# Altium schematic sheet Processing.SchDoc
size A1; PageSetup: Record=PageOptions|CenterHorizontal=True|CenterVertical=True|PrintScale=1.00|XCorrection=1.00|YCorrection=1.00|PrintKind=1|BorderSize=5000000|LeftOffset=0|BottomOffset=0|Orientation=2|PaperLength=1000|PaperWidth=1000|Scale=100|PaperSource=7|PrintQuality=-4|MediaType=1|DitherType=10|PaperKind=A4|PrintScaleMode=0
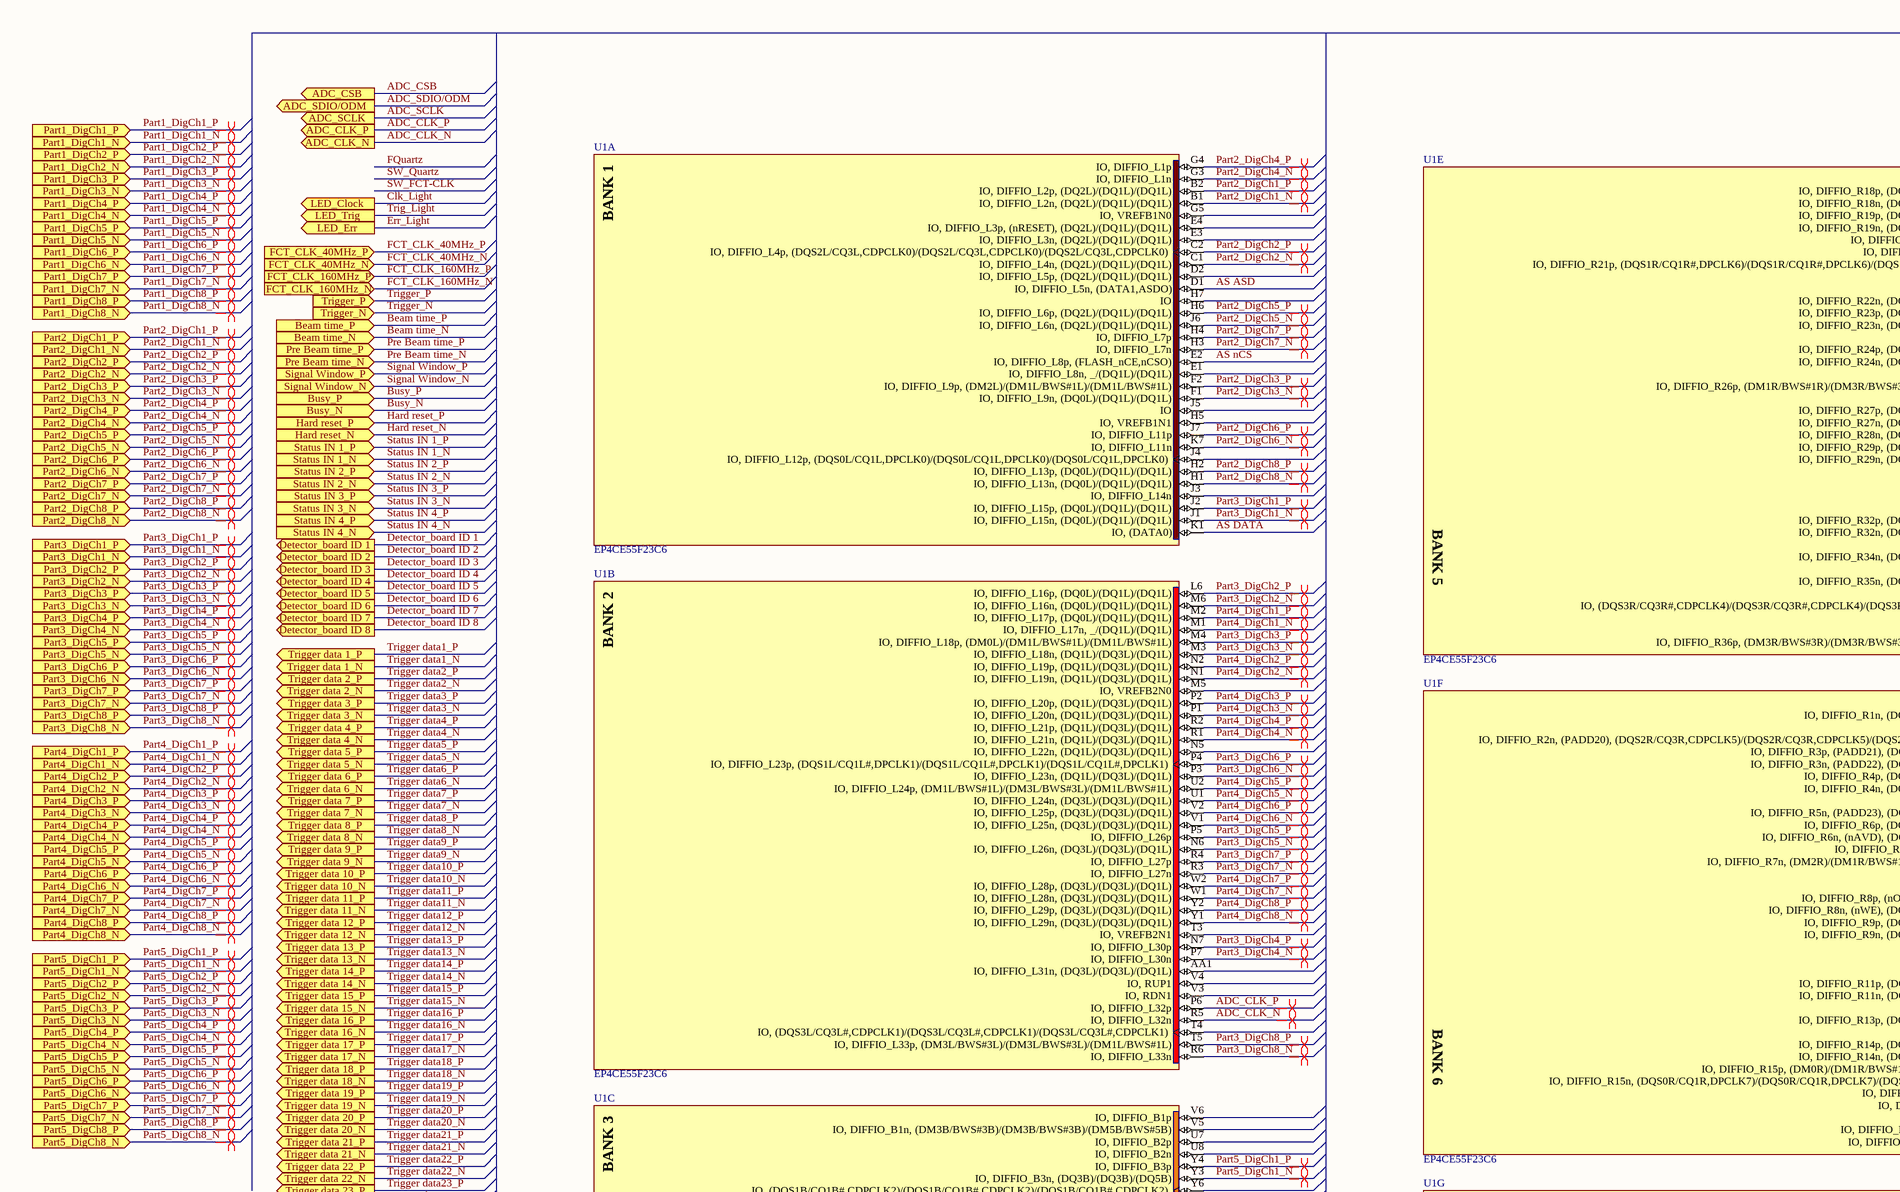
[diagram p0: Processing.SchDoc, top left]
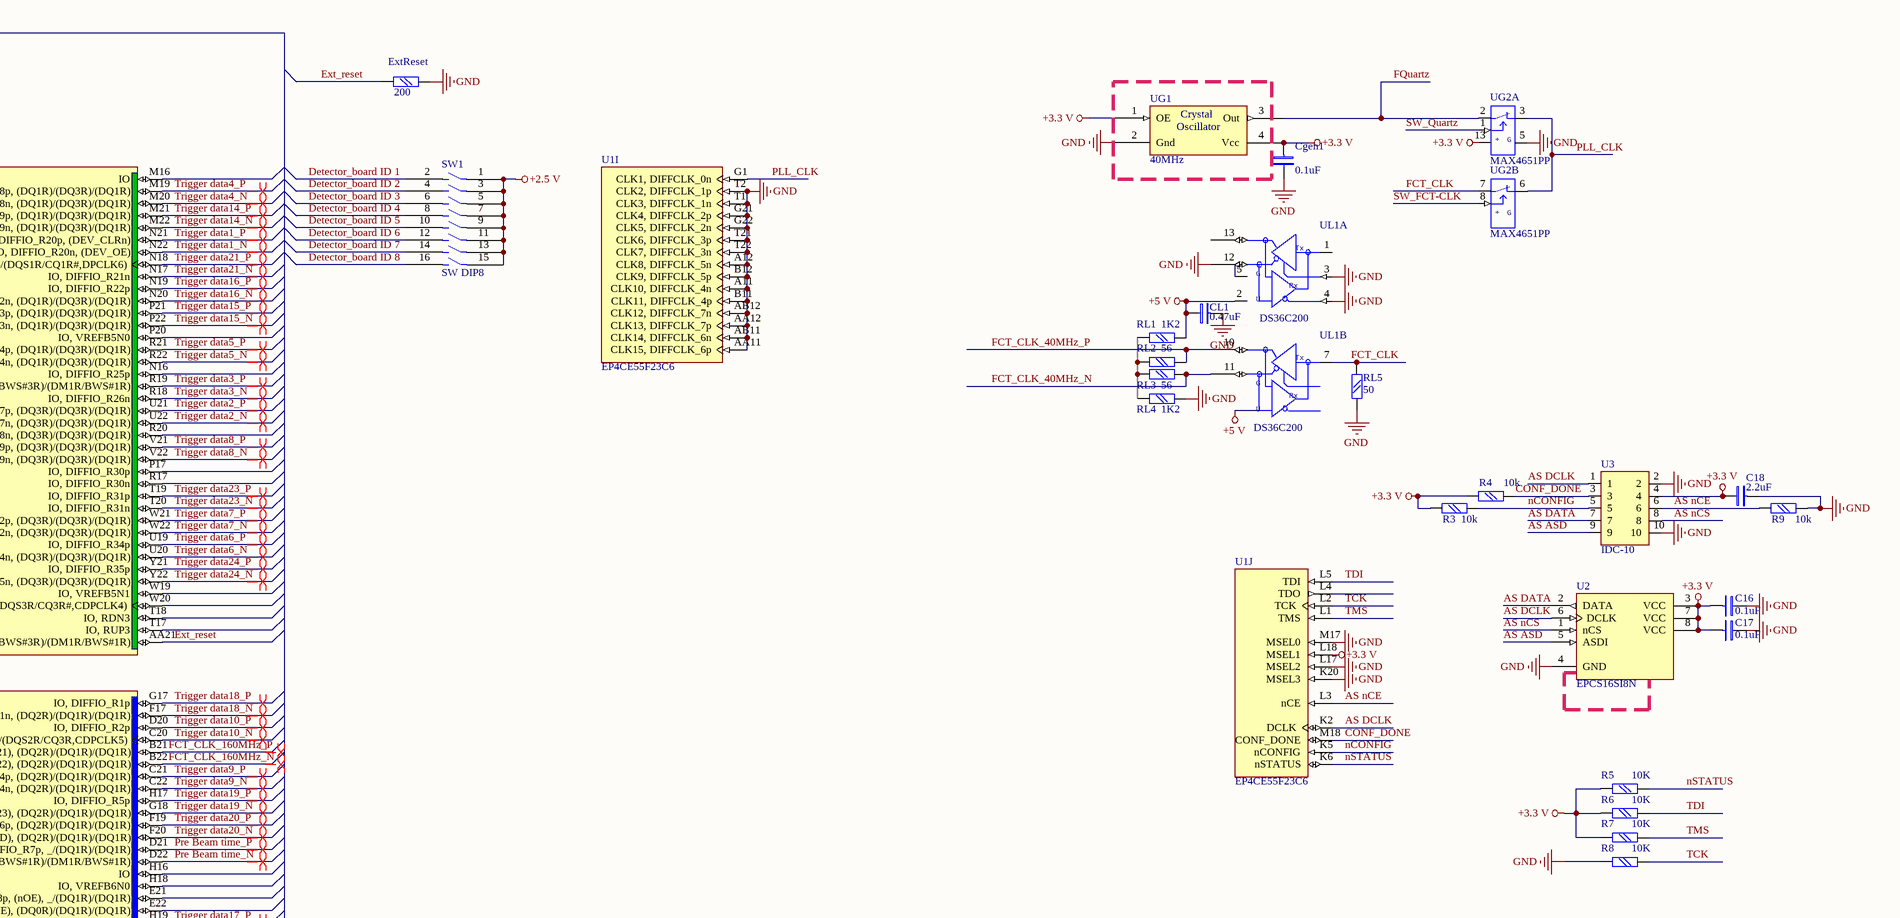
[diagram p1: Processing.SchDoc, top right]
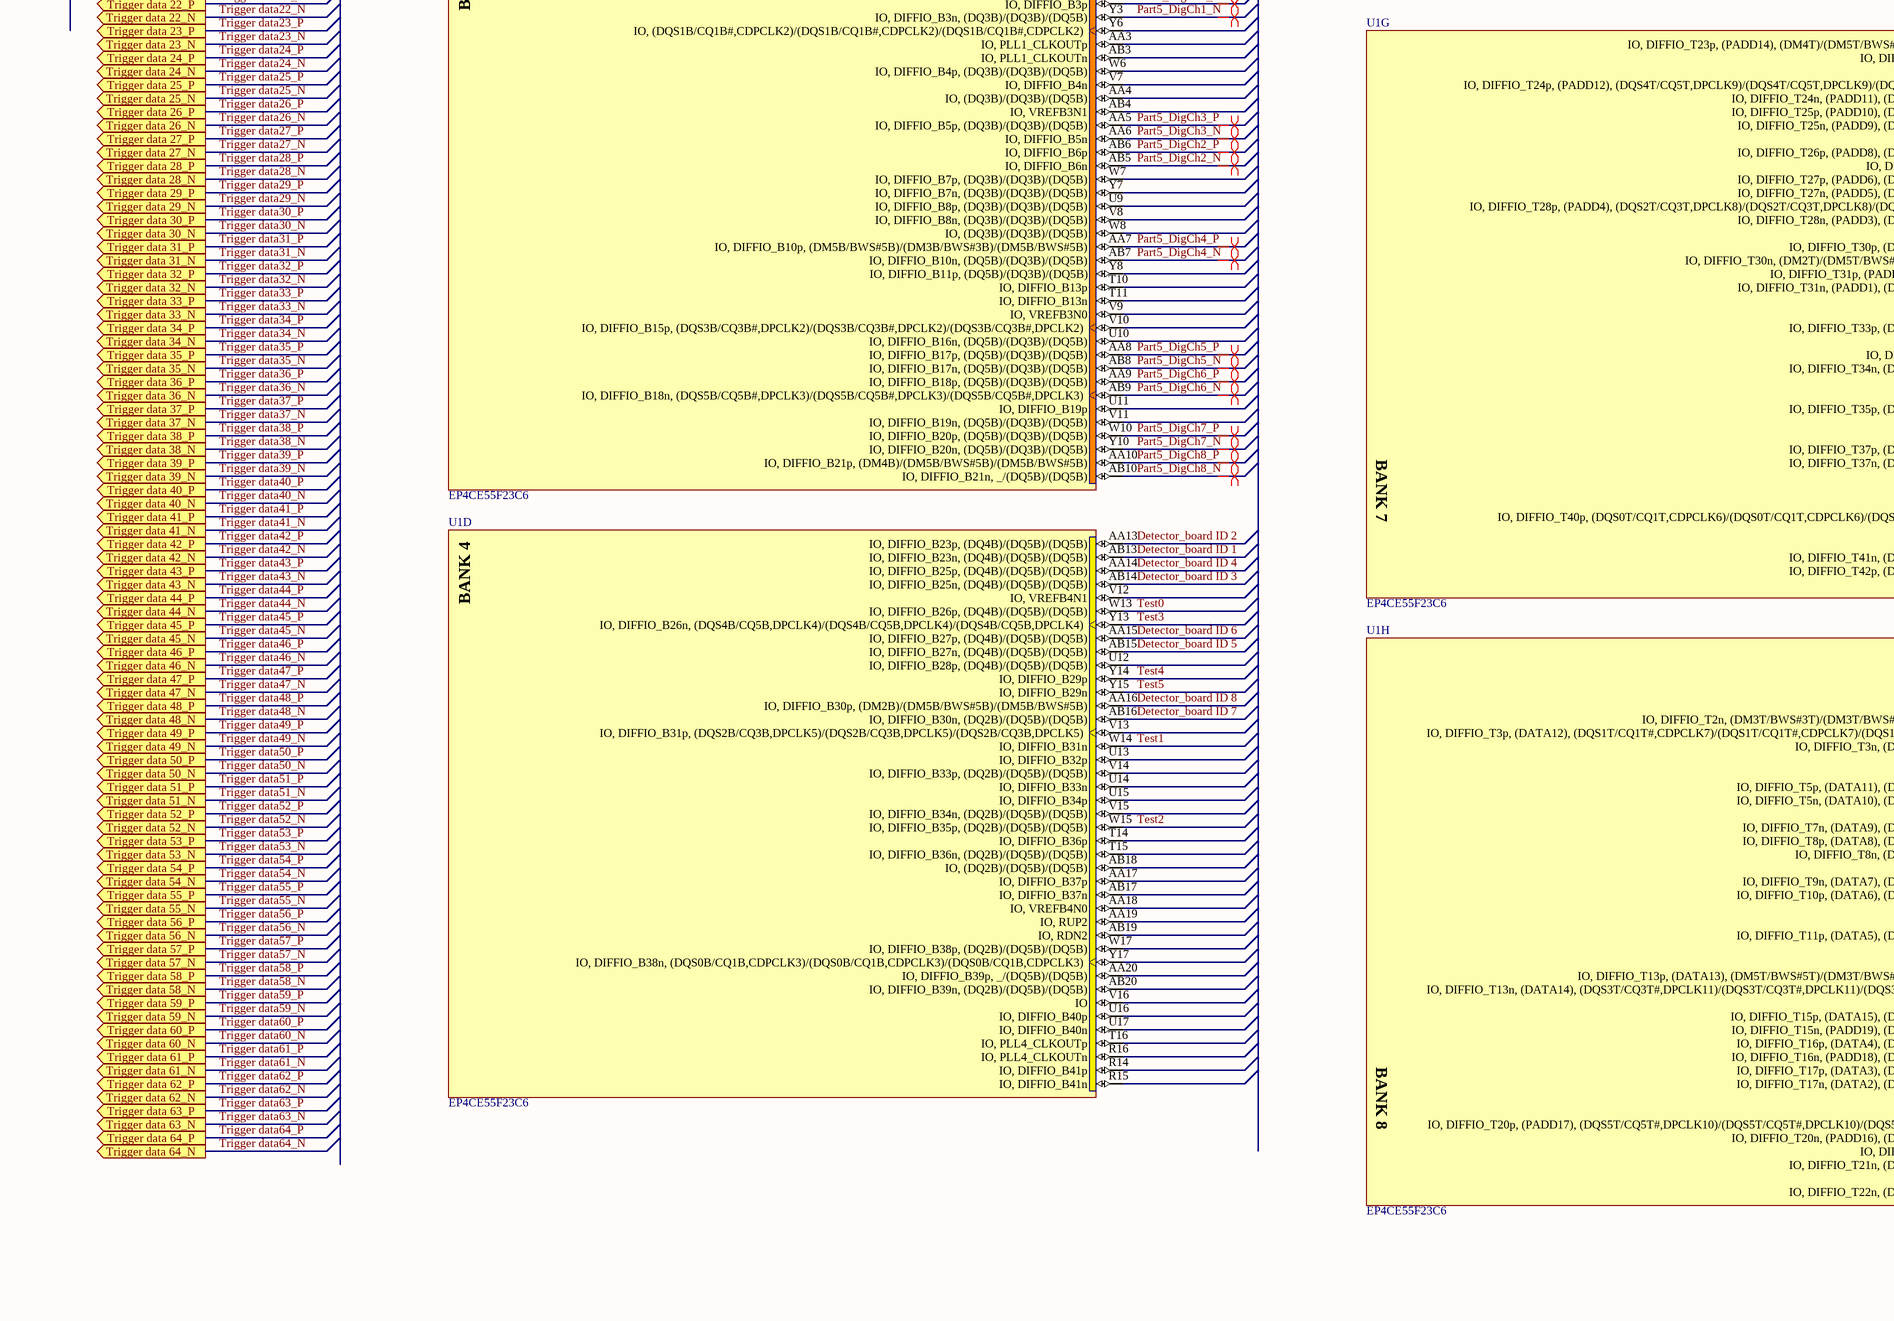
[diagram p2: Processing.SchDoc, bottom left]
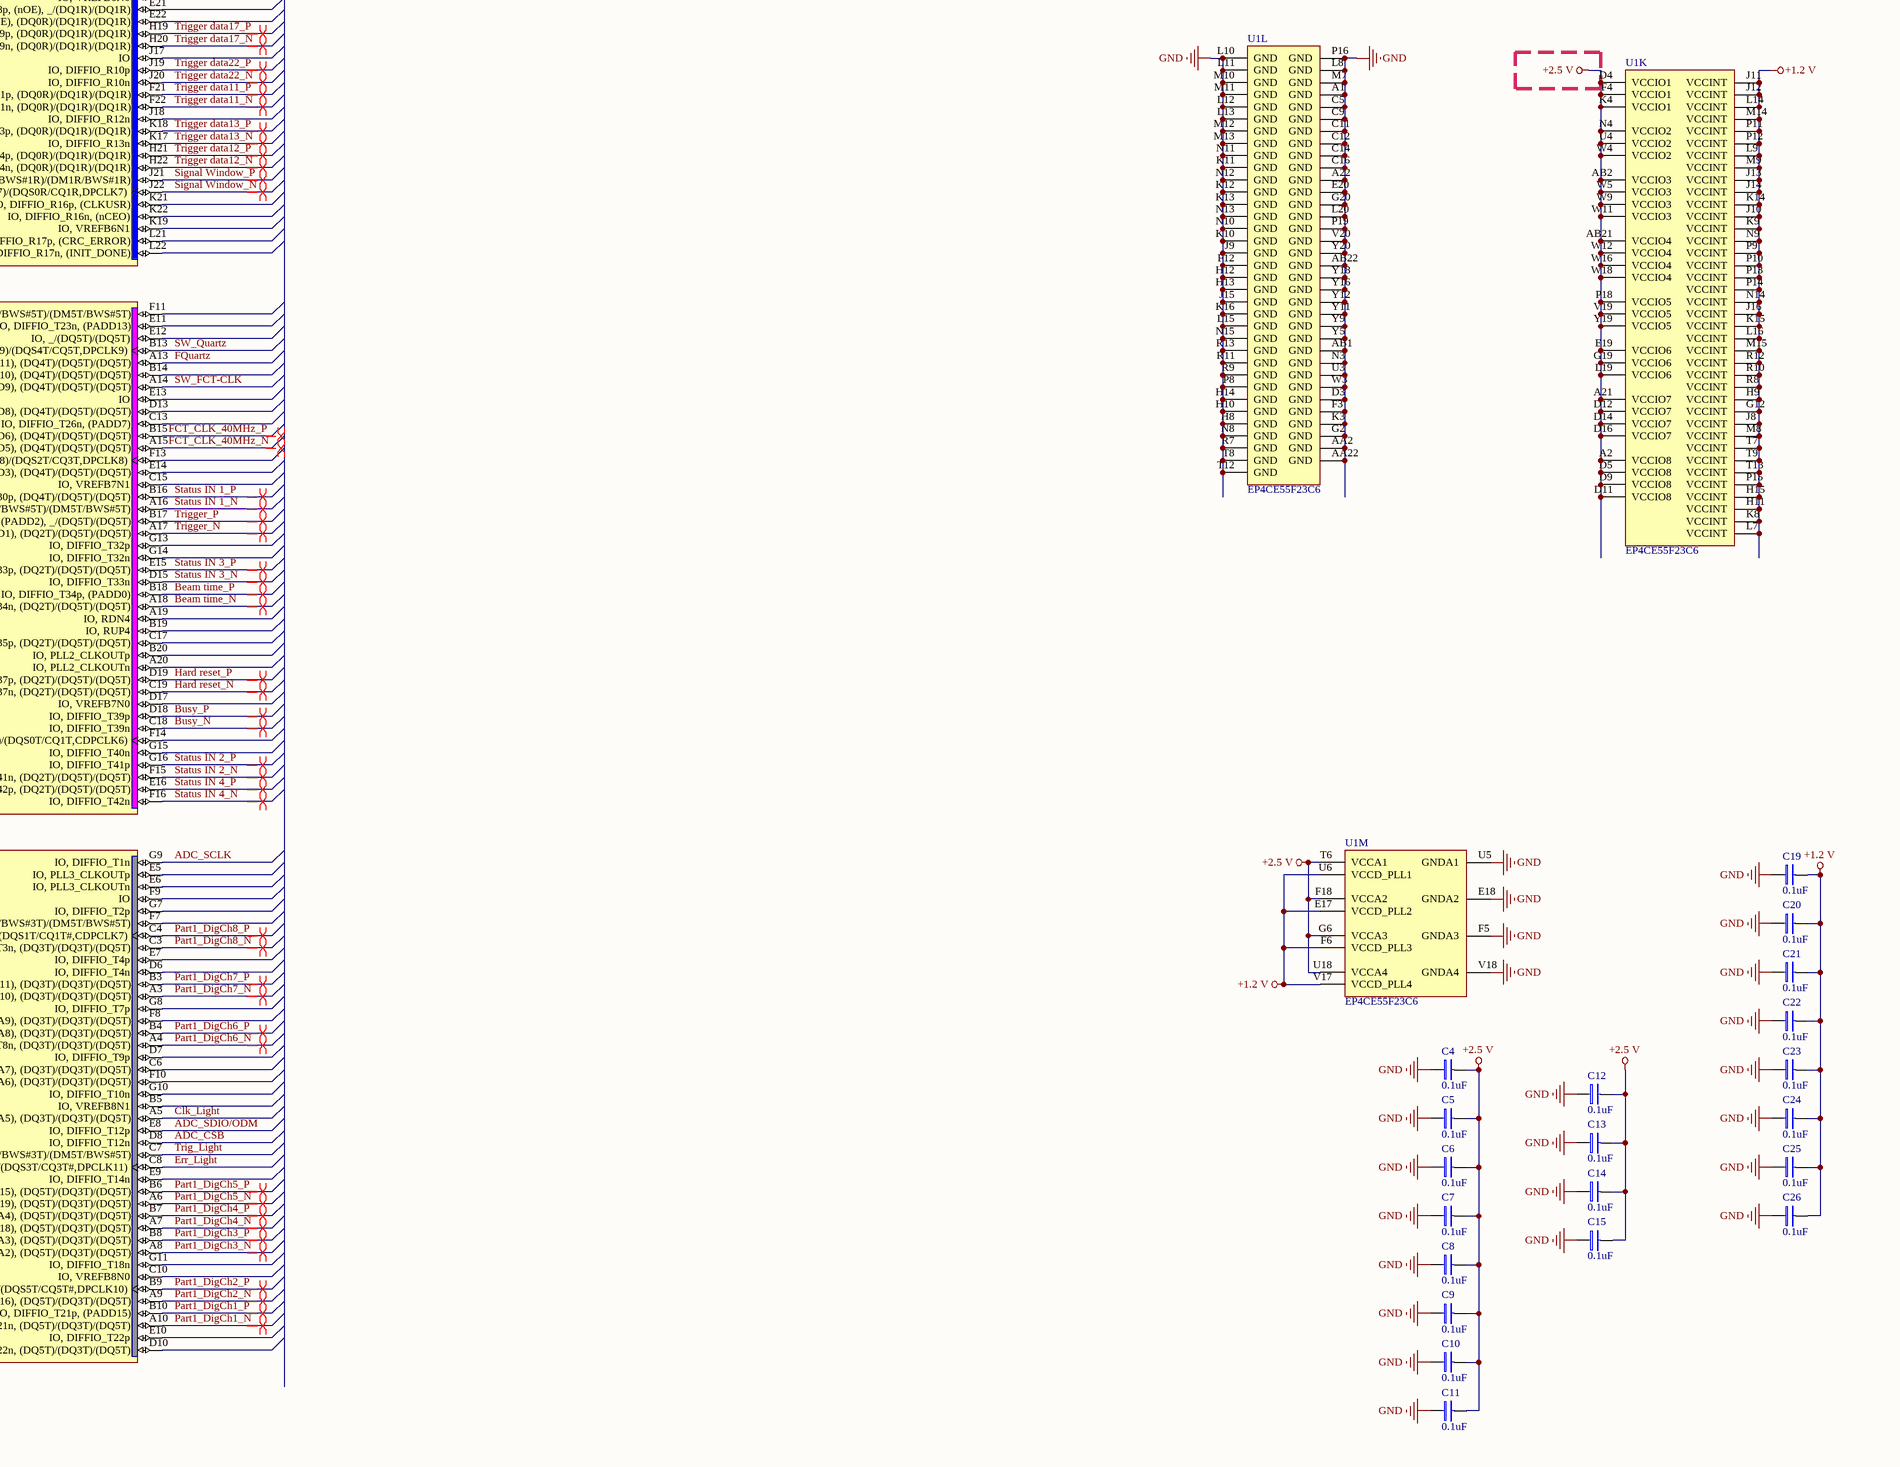
[diagram p3: Processing.SchDoc, bottom right]

## Parts
C4  0.1uF  [chip0603]
C5  0.1uF  [chip0603]
C6  0.1uF  [chip0603]
C7  0.1uF  [chip0603]
C8  0.1uF  [chip0603]
C9  0.1uF  [chip0603]
C10  0.1uF  [chip0603]
C11  0.1uF  [chip0603]
C12  0.1uF  [chip0603]
C13  0.1uF  [chip0603]
C14  0.1uF  [chip0603]
C15  0.1uF  [chip0603]
C16  0.1uF  [chip0603]
C17  0.1uF  [chip0603]
C18  2.2uF  [chip0603]
C19  0.1uF  [chip0603]
C20  0.1uF  [chip0603]
C21  0.1uF  [chip0603]
C22  0.1uF  [chip0603]
C23  0.1uF  [chip0603]
C24  0.1uF  [chip0603]
C25  0.1uF  [chip0603]
C26  0.1uF  [chip0603]
Cgen1  0.1uF  [chip0603]
CL1  0.47uF  [chip0603]
ExtReset  200  [chip0603]
R3  10k  [chip0603]
R4  10k  [chip0603]
R5  10K  [chip0603]
R6  10K  [chip0603]
R7  10K  [chip0603]
R8  10K  [chip0603]
R9  10k  [chip0603]
RL1  1K2  [chip0603]
RL2  56  [chip0603]
RL3  56  [chip0603]
RL4  1K2  [chip0603]
RL5  50  [chip0603]
SW1  SW DIP8  [SWD4-8]
U1  EP4CE55F23C6  [FBGA484]  (parts A,B,C,D,E,F,G,H,I,J,K,L,M of 13)
U2  EPCS16SI8N  [SOIC8_N]
U3  IDC-10  [IDC10]
UG1  40MHz  [SG-636]
UG2  MAX4651PP  [16SOIC150]  (parts A,B of 4)
UL1  DS36C200  [14SO200]  (parts A,B of 2)

## Ports
ADC_CLK_N (out), ADC_CLK_P (out), ADC_CSB (out), ADC_SCLK (out), ADC_SDIO/ODM (out), Beam time_N (in), Beam time_P (in), Busy_N (in), Busy_P (in), Detector_board ID 1 (out), Detector_board ID 2 (out), Detector_board ID 3 (out), Detector_board ID 4 (out), Detector_board ID 5 (out), Detector_board ID 6 (out), Detector_board ID 7 (out), Detector_board ID 8 (out), FCT_CLK_40MHz_N (in), FCT_CLK_40MHz_P (in), FCT_CLK_160MHz_N (in), FCT_CLK_160MHz_P (in), Hard reset_N (in), Hard reset_P (in), LED_Clock (out), LED_Err (out), LED_Trig (out), Part1_DigCh1_N (in), Part1_DigCh1_P (in), Part1_DigCh2_N (in), Part1_DigCh2_P (in), Part1_DigCh3_N (in), Part1_DigCh3_P (in), Part1_DigCh4_N (in), Part1_DigCh4_P (in), Part1_DigCh5_N (in), Part1_DigCh5_P (in), Part1_DigCh6_N (in), Part1_DigCh6_P (in), Part1_DigCh7_N (in), Part1_DigCh7_P (in), Part1_DigCh8_N (in), Part1_DigCh8_P (in), Part2_DigCh1_N (in), Part2_DigCh1_P (in), Part2_DigCh2_N (in), Part2_DigCh2_P (in), Part2_DigCh3_N (in), Part2_DigCh3_P (in), Part2_DigCh4_N (in), Part2_DigCh4_P (in), Part2_DigCh5_N (in), Part2_DigCh5_P (in), Part2_DigCh6_N (in), Part2_DigCh6_P (in), Part2_DigCh7_N (in), Part2_DigCh7_P (in), Part2_DigCh8_N (in), Part2_DigCh8_P (in), Part3_DigCh1_N (in), Part3_DigCh1_P (in), Part3_DigCh2_N (in), Part3_DigCh2_P (in), Part3_DigCh3_N (in), Part3_DigCh3_P (in), Part3_DigCh4_N (in), Part3_DigCh4_P (in), Part3_DigCh5_N (in), Part3_DigCh5_P (in), Part3_DigCh6_N (in), Part3_DigCh6_P (in), Part3_DigCh7_N (in), Part3_DigCh7_P (in), Part3_DigCh8_N (in), Part3_DigCh8_P (in), Part4_DigCh1_N (in), Part4_DigCh1_P (in), Part4_DigCh2_N (in), Part4_DigCh2_P (in), Part4_DigCh3_N (in), Part4_DigCh3_P (in), Part4_DigCh4_N (in), Part4_DigCh4_P (in), Part4_DigCh5_N (in), Part4_DigCh5_P (in), Part4_DigCh6_N (in), Part4_DigCh6_P (in), Part4_DigCh7_N (in), Part4_DigCh7_P (in), Part4_DigCh8_N (in), Part4_DigCh8_P (in), Part5_DigCh1_N (in), Part5_DigCh1_P (in), Part5_DigCh2_N (in), Part5_DigCh2_P (in), Part5_DigCh3_N (in), Part5_DigCh3_P (in), Part5_DigCh4_N (in), Part5_DigCh4_P (in), Part5_DigCh5_N (in), Part5_DigCh5_P (in), Part5_DigCh6_N (in), Part5_DigCh6_P (in), Part5_DigCh7_N (in), Part5_DigCh7_P (in), Part5_DigCh8_N (in), Part5_DigCh8_P (in), Pre Beam time_N (in), Pre Beam time_P (in), Signal Window_N (in), Signal Window_P (in), Status IN 1_N (in), Status IN 1_P (in), Status IN 2_N (in), Status IN 2_P (in), Status IN 3_N (in), Status IN 3_P (in), Status IN 4_N (in), Status IN 4_P (in), Trigger data 1_N (out), Trigger data 1_P (out), Trigger data 2_N (out), Trigger data 2_P (out), Trigger data 3_N (out), Trigger data 3_P (out), Trigger data 4_N (out), Trigger data 4_P (out), Trigger data 5_N (out), Trigger data 5_P (out), Trigger data 6_N (out), Trigger data 6_P (out), Trigger data 7_N (out), Trigger data 7_P (out), Trigger data 8_N (out), Trigger data 8_P (out), Trigger data 9_N (out), Trigger data 9_P (out), Trigger data 10_N (out), Trigger data 10_P (out), Trigger data 11_N (out), Trigger data 11_P (out), Trigger data 12_N (out), Trigger data 12_P (out), Trigger data 13_N (out), Trigger data 13_P (out), Trigger data 14_N (out), Trigger data 14_P (out), Trigger data 15_N (out), Trigger data 15_P (out), Trigger data 16_N (out), Trigger data 16_P (out), Trigger data 17_N (out), Trigger data 17_P (out), Trigger data 18_N (out), Trigger data 18_P (out), Trigger data 19_N (out), Trigger data 19_P (out), Trigger data 20_N (out), Trigger data 20_P (out), Trigger data 21_N (out), Trigger data 21_P (out), Trigger data 22_N (out), Trigger data 22_P (out), Trigger data 23_N (out), Trigger data 23_P (out), Trigger data 24_N (out), Trigger data 24_P (out), Trigger data 25_N (out), Trigger data 25_P (out), Trigger data 26_N (out), Trigger data 26_P (out), Trigger data 27_N (out), Trigger data 27_P (out), Trigger data 28_N (out), Trigger data 28_P (out), Trigger data 29_N (out), Trigger data 29_P (out), Trigger data 30_N (out), Trigger data 30_P (out), Trigger data 31_N (out), Trigger data 31_P (out), Trigger data 32_N (out), Trigger data 32_P (out), Trigger data 33_N (out), Trigger data 33_P (out), Trigger data 34_N (out), Trigger data 34_P (out), Trigger data 35_N (out), Trigger data 35_P (out), Trigger data 36_N (out), Trigger data 36_P (out), Trigger data 37_N (out), Trigger data 37_P (out), Trigger data 38_N (out), Trigger data 38_P (out), Trigger data 39_N (out), Trigger data 39_P (out), Trigger data 40_N (out), Trigger data 40_P (out), Trigger data 41_N (out), Trigger data 41_P (out), Trigger data 42_N (out), Trigger data 42_P (out), Trigger data 43_N (out), Trigger data 43_P (out), Trigger data 44_N (out), Trigger data 44_P (out), Trigger data 45_N (out), Trigger data 45_P (out), Trigger data 46_N (out), Trigger data 46_P (out), Trigger data 47_N (out), Trigger data 47_P (out), Trigger data 48_N (out), Trigger data 48_P (out), Trigger data 49_N (out), Trigger data 49_P (out), Trigger data 50_N (out), Trigger data 50_P (out), Trigger data 51_N (out), Trigger data 51_P (out), Trigger data 52_N (out), Trigger data 52_P (out), Trigger data 53_N (out), Trigger data 53_P (out), Trigger data 54_N (out), Trigger data 54_P (out), Trigger data 55_N (out), Trigger data 55_P (out), Trigger data 56_N (out), Trigger data 56_P (out), Trigger data 57_N (out), Trigger data 57_P (out), Trigger data 58_N (out), Trigger data 58_P (out), Trigger data 59_N (out), Trigger data 59_P (out), Trigger data 60_N (out), Trigger data 60_P (out), Trigger data 61_N (out), Trigger data 61_P (out), Trigger data 62_N (out), Trigger data 62_P (out), Trigger data 63_N (out), Trigger data 63_P (out), Trigger data 64_N (out), Trigger data 64_P (out), Trigger_N (in), Trigger_P (in)

## Nets
+1.2 V: C19.2 C20.2 C21.2 C22.2 C23.2 C24.2 C25.2 C26.2 U1.E17(VCCD_PLL2) U1.F6(VCCD_PLL3) U1.G12(VCCINT) U1.H9(VCCINT) U1.H11(VCCINT) U1.H15(VCCINT) U1.J8(VCCINT) U1.J10(VCCINT) U1.J11(VCCINT) U1.J12(VCCINT) U1.J13(VCCINT) U1.J14(VCCINT) U1.J16(VCCINT) U1.K8(VCCINT) U1.K9(VCCINT) U1.K14(VCCINT) U1.K15(VCCINT) U1.L7(VCCINT) U1.L9(VCCINT) U1.L14(VCCINT) U1.L16(VCCINT) U1.M8(VCCINT) U1.M9(VCCINT) U1.M14(VCCINT) U1.M15(VCCINT) U1.N9(VCCINT) U1.N14(VCCINT) U1.P9(VCCINT) U1.P10(VCCINT) U1.P11(VCCINT) U1.P12(VCCINT) U1.P13(VCCINT) U1.P14(VCCINT) U1.P15(VCCINT) U1.R8(VCCINT) U1.R10(VCCINT) U1.R12(VCCINT) U1.T7(VCCINT) U1.T9(VCCINT) U1.T13(VCCINT) U1.U6(VCCD_PLL1) U1.V17(VCCD_PLL4)
+2.5 V: C4.2 C5.2 C6.2 C7.2 C8.2 C9.2 C10.2 C11.2 C12.2 C13.2 C14.2 C15.2 SW1.1 SW1.3 SW1.5 SW1.7 SW1.9 SW1.11 SW1.13 SW1.15 U1.A2(VCCIO8) U1.A21(VCCIO7) U1.AB2(VCCIO3) U1.AB21(VCCIO4) U1.D4(VCCIO1) U1.D5(VCCIO8) U1.D9(VCCIO8) U1.D11(VCCIO8) U1.D12(VCCIO7) U1.D14(VCCIO7) U1.D16(VCCIO7) U1.E19(VCCIO6) U1.F4(VCCIO1) U1.F18(VCCA2) U1.G6(VCCA3) U1.G19(VCCIO6) U1.K4(VCCIO1) U1.L19(VCCIO6) U1.N4(VCCIO2) U1.P18(VCCIO5) U1.T6(VCCA1) U1.U4(VCCIO2) U1.U18(VCCA4) U1.V19(VCCIO5) U1.W4(VCCIO2) U1.W5(VCCIO3) U1.W9(VCCIO3) U1.W11(VCCIO3) U1.W12(VCCIO4) U1.W16(VCCIO4) U1.W18(VCCIO4) U1.Y19(VCCIO5)
+3.3 V: C16.2 C17.2 C18.1 Cgen1.2 R3.1 R4.1 R5.1 R6.1 R7.1 U1.L18(MSEL1) U2.3(VCC) U2.7(VCC) U2.8(VCC) U3.4 UG1.1(OE) UG1.4(Vcc) UG2.13(VCC)
+5 V: CL1.1 RL1.2 UL1.2(VCC)
GND: C4.1 C5.1 C6.1 C7.1 C8.1 C9.1 C10.1 C11.1 C12.1 C13.1 C14.1 C15.1 C16.1 C17.1 C18.2 C19.1 C20.1 C21.1 C22.1 C23.1 C24.1 C25.1 C26.1 Cgen1.1 CL1.2 ExtReset.2 R8.1 R9.2 RL4.2 RL5.2 U1.A1(GND) U1.A11(CLK10,_DIFFCLK_4n) U1.A12(CLK8,_DIFFCLK_5n) U1.A22(GND) U1.AA2(GND) U1.AA11(CLK15,_DIFFCLK_6p) U1.AA12(CLK13,_DIFFCLK_7p) U1.AA22(GND) U1.AB1(GND) U1.AB11(CLK14,_DIFFCLK_6n) U1.AB12(CLK12,_DIFFCLK_7n) U1.AB22(GND) U1.B11(CLK11,_DIFFCLK_4p) U1.B12(CLK9,_DIFFCLK_5p) U1.C5(GND) U1.C9(GND) U1.C11(GND) U1.C12(GND) U1.C14(GND) U1.C16(GND) U1.D3(GND) U1.E18(GNDA2) U1.E20(GND) U1.F3(GND) U1.F5(GNDA3) U1.F12(GND) U1.G2(GND) U1.G20(GND) U1.G21(CLK4,_DIFFCLK_2p) U1.G22(CLK5,_DIFFCLK_2n) U1.H8(GND) U1.H10(GND) U1.H12(GND) U1.H13(GND) U1.H14(GND) U1.J9(GND) U1.J15(GND) U1.K3(GND) U1.K10(GND) U1.K11(GND) U1.K12(GND) U1.K13(GND) U1.K16(GND) U1.K20(MSEL3) U1.L8(GND) U1.L10(GND) U1.L11(GND) U1.L12(GND) U1.L13(GND) U1.L15(GND) U1.L17(MSEL2) U1.L20(GND) U1.M7(GND) U1.M10(GND) U1.M11(GND) U1.M12(GND) U1.M13(GND) U1.M17(MSEL0) U1.N3(GND) U1.N8(GND) U1.N10(GND) U1.N11(GND) U1.N12(GND) U1.N13(GND) U1.N15(GND) U1.P8(GND) U1.P16(GND) U1.P19(GND) U1.R7(GND) U1.R9(GND) U1.R11(GND) U1.R13(GND) U1.T1(CLK3,_DIFFCLK_1n) U1.T2(CLK2,_DIFFCLK_1p) U1.T8(GND) U1.T12(GND) U1.T21(CLK6,_DIFFCLK_3p) U1.T22(CLK7,_DIFFCLK_3n) U1.U3(GND) U1.U5(GNDA1) U1.V18(GNDA4) U1.V20(GND) U1.W3(GND) U1.Y5(GND) U1.Y9(GND) U1.Y11(GND) U1.Y12(GND) U1.Y16(GND) U1.Y18(GND) U1.Y20(GND) U2.4(GND) U3.2 U3.10 UG1.2(Gnd) UG2.5(GND) UL1.3(TE) UL1.4(RE) UL1.12(WIRE-)
ADC_CLK_N: U1.R5(IO,_DIFFIO_L32n) ; port ADC_CLK_N
ADC_CLK_P: U1.P6(IO,_DIFFIO_L32p) ; port ADC_CLK_P
ADC_CSB: U1.D8(IO,_DIFFIO_T12n) ; port ADC_CSB
ADC_SCLK: U1.G9(IO,_DIFFIO_T1n) ; port ADC_SCLK
ADC_SDIO/ODM: U1.E8(IO,_DIFFIO_T12p) ; port ADC_SDIO/ODM
AS ASD: U1.D1(IO,_DIFFIO_L5n,_(DATA1,ASDO)) U2.5(ASDI) U3.9
AS DATA: U1.K1(IO,_(DATA0)) U2.2(DATA) U3.7
AS DCLK: U1.K2(DCLK) U2.6(DCLK) U3.1
AS nCE: R9.1 U1.L3(nCE) U3.6
AS nCS: U1.E2(IO,_DIFFIO_L8p,_(FLASH_nCE,nCSO)) U2.1(nCS) U3.8
Beam time_N: U1.A18(IO,_DIFFIO_T34n,_(DQ2T)/(DQ5T)/(DQ5T)) ; port Beam time_N
Beam time_P: U1.B18(IO,_DIFFIO_T34p,_(PADD0)) ; port Beam time_P
Busy_N: U1.C18(IO,_DIFFIO_T39n) ; port Busy_N
Busy_P: U1.D18(IO,_DIFFIO_T39p) ; port Busy_P
Clk_Light: U1.A5(IO,_DIFFIO_T11p,_(DATA5),_(DQ3T)/(DQ3T)/(DQ5T)) ; port LED_Clock
CONF_DONE: R4.2 U1.M18(CONF_DONE) U3.3
Detector_board ID 1: SW1.2 U1.AB13(IO,_DIFFIO_B23n,_(DQ4B)/(DQ5B)/(DQ5B)) ; port Detector_board ID 1
Detector_board ID 2: SW1.4 U1.AA13(IO,_DIFFIO_B23p,_(DQ4B)/(DQ5B)/(DQ5B)) ; port Detector_board ID 2
Detector_board ID 3: SW1.6 U1.AB14(IO,_DIFFIO_B25n,_(DQ4B)/(DQ5B)/(DQ5B)) ; port Detector_board ID 3
Detector_board ID 4: SW1.8 U1.AA14(IO,_DIFFIO_B25p,_(DQ4B)/(DQ5B)/(DQ5B)) ; port Detector_board ID 4
Detector_board ID 5: SW1.10 U1.AB15(IO,_DIFFIO_B27n,_(DQ4B)/(DQ5B)/(DQ5B)) ; port Detector_board ID 5
Detector_board ID 6: SW1.12 U1.AA15(IO,_DIFFIO_B27p,_(DQ4B)/(DQ5B)/(DQ5B)) ; port Detector_board ID 6
Detector_board ID 7: SW1.14 U1.AB16(IO,_DIFFIO_B30n,_(DQ2B)/(DQ5B)/(DQ5B)) ; port Detector_board ID 7
Detector_board ID 8: SW1.16 U1.AA16(IO,_DIFFIO_B30p,_(DM2B)/(DM5B/BWS#5B)/(DM5B/BWS#5B)) ; port Detector_board ID 8
Err_Light: U1.C8(IO,_DIFFIO_T13n,_(DATA14),_(DQS3T/CQ3T#,DPCLK11)/(DQS3T/CQ3T#,DPCLK11)/(DQS3T/CQ3T#,DPCLK11)) ; port LED_Err
Ext_reset: ExtReset.1 U1.AA21(IO,_DIFFIO_R36p,_(DM3R/BWS#3R)/(DM3R/BWS#3R)/(DM1R/BWS#1R))
FCT_CLK: RL5.1 UG2.7(IN) UL1.7(DATA)
FCT_CLK_40MHz_N: RL3.2 U1.A15(IO,_DIFFIO_T27n,_(PADD5),_(DQ4T)/(DQ5T)/(DQ5T)) UL1.11(WIRE-) ; port FCT_CLK_40MHz_N
FCT_CLK_40MHz_P: RL2.2 U1.B15(IO,_DIFFIO_T27p,_(PADD6),_(DQ4T)/(DQ5T)/(DQ5T)) UL1.10(WIRE+) ; port FCT_CLK_40MHz_P
FCT_CLK_160MHz_N: U1.B22(IO,_DIFFIO_R3n,_(PADD22),_(DQ2R)/(DQ1R)/(DQ1R)) ; port FCT_CLK_160MHz_N
FCT_CLK_160MHz_P: U1.B21(IO,_DIFFIO_R3p,_(PADD21),_(DQ2R)/(DQ1R)/(DQ1R)) ; port FCT_CLK_160MHz_P
FQuartz: U1.A13(IO,_DIFFIO_T24n,_(PADD11),_(DQ4T)/(DQ5T)/(DQ5T)) UG1.3(Out) UG2.2(IN)
Hard reset_N: U1.C19(IO,_DIFFIO_T37n,_(DQ2T)/(DQ5T)/(DQ5T)) ; port Hard reset_N
Hard reset_P: U1.D19(IO,_DIFFIO_T37p,_(DQ2T)/(DQ5T)/(DQ5T)) ; port Hard reset_P
nCONFIG: R3.2 U1.K5(nCONFIG) U3.5
nSTATUS: R5.2 U1.K6(nSTATUS)
Part1_DigCh1_N: U1.A10(IO,_DIFFIO_T21n,_(DQ5T)/(DQ3T)/(DQ5T)) ; port Part1_DigCh1_N
Part1_DigCh1_P: U1.B10(IO,_DIFFIO_T21p,_(PADD15)) ; port Part1_DigCh1_P
Part1_DigCh2_N: U1.A9(IO,_DIFFIO_T20n,_(PADD16),_(DQ5T)/(DQ3T)/(DQ5T)) ; port Part1_DigCh2_N
Part1_DigCh2_P: U1.B9(IO,_DIFFIO_T20p,_(PADD17),_(DQS5T/CQ5T#,DPCLK10)/(DQS5T/CQ5T#,DPCLK10)/(DQS5T/CQ5T#,DPCLK10)) ; port Part1_DigCh2_P
Part1_DigCh3_N: U1.A8(IO,_DIFFIO_T17n,_(DATA2),_(DQ5T)/(DQ3T)/(DQ5T)) ; port Part1_DigCh3_N
Part1_DigCh3_P: U1.B8(IO,_DIFFIO_T17p,_(DATA3),_(DQ5T)/(DQ3T)/(DQ5T)) ; port Part1_DigCh3_P
Part1_DigCh4_N: U1.A7(IO,_DIFFIO_T16n,_(PADD18),_(DQ5T)/(DQ3T)/(DQ5T)) ; port Part1_DigCh4_N
Part1_DigCh4_P: U1.B7(IO,_DIFFIO_T16p,_(DATA4),_(DQ5T)/(DQ3T)/(DQ5T)) ; port Part1_DigCh4_P
Part1_DigCh5_N: U1.A6(IO,_DIFFIO_T15n,_(PADD19),_(DQ5T)/(DQ3T)/(DQ5T)) ; port Part1_DigCh5_N
Part1_DigCh5_P: U1.B6(IO,_DIFFIO_T15p,_(DATA15),_(DQ5T)/(DQ3T)/(DQ5T)) ; port Part1_DigCh5_P
Part1_DigCh6_N: U1.A4(IO,_DIFFIO_T8n,_(DQ3T)/(DQ3T)/(DQ5T)) ; port Part1_DigCh6_N
Part1_DigCh6_P: U1.B4(IO,_DIFFIO_T8p,_(DATA8),_(DQ3T)/(DQ3T)/(DQ5T)) ; port Part1_DigCh6_P
Part1_DigCh7_N: U1.A3(IO,_DIFFIO_T5n,_(DATA10),_(DQ3T)/(DQ3T)/(DQ5T)) ; port Part1_DigCh7_N
Part1_DigCh7_P: U1.B3(IO,_DIFFIO_T5p,_(DATA11),_(DQ3T)/(DQ3T)/(DQ5T)) ; port Part1_DigCh7_P
Part1_DigCh8_N: U1.C3(IO,_DIFFIO_T3n,_(DQ3T)/(DQ3T)/(DQ5T)) ; port Part1_DigCh8_N
Part1_DigCh8_P: U1.C4(IO,_DIFFIO_T3p,_(DATA12),_(DQS1T/CQ1T#,CDPCLK7)/(DQS1T/CQ1T#,CDPCLK7)/(DQS1T/CQ1T#,CDPCLK7)) ; port Part1_DigCh8_P
Part2_DigCh1_N: U1.B1(IO,_DIFFIO_L2n,_(DQ2L)/(DQ1L)/(DQ1L)) ; port Part2_DigCh1_N
Part2_DigCh1_P: U1.B2(IO,_DIFFIO_L2p,_(DQ2L)/(DQ1L)/(DQ1L)) ; port Part2_DigCh1_P
Part2_DigCh2_N: U1.C1(IO,_DIFFIO_L4n,_(DQ2L)/(DQ1L)/(DQ1L)) ; port Part2_DigCh2_N
Part2_DigCh2_P: U1.C2(IO,_DIFFIO_L4p,_(DQS2L/CQ3L,CDPCLK0)/(DQS2L/CQ3L,CDPCLK0)/(DQS2L/CQ3L,CDPCLK0)) ; port Part2_DigCh2_P
Part2_DigCh3_N: U1.F1(IO,_DIFFIO_L9n,_(DQ0L)/(DQ1L)/(DQ1L)) ; port Part2_DigCh3_N
Part2_DigCh3_P: U1.F2(IO,_DIFFIO_L9p,_(DM2L)/(DM1L/BWS#1L)/(DM1L/BWS#1L)) ; port Part2_DigCh3_P
Part2_DigCh4_N: U1.G3(IO,_DIFFIO_L1n) ; port Part2_DigCh4_N
Part2_DigCh4_P: U1.G4(IO,_DIFFIO_L1p) ; port Part2_DigCh4_P
Part2_DigCh5_N: U1.J6(IO,_DIFFIO_L6n,_(DQ2L)/(DQ1L)/(DQ1L)) ; port Part2_DigCh5_N
Part2_DigCh5_P: U1.H6(IO,_DIFFIO_L6p,_(DQ2L)/(DQ1L)/(DQ1L)) ; port Part2_DigCh5_P
Part2_DigCh6_N: U1.K7(IO,_DIFFIO_L11n) ; port Part2_DigCh6_N
Part2_DigCh6_P: U1.J7(IO,_DIFFIO_L11p) ; port Part2_DigCh6_P
Part2_DigCh7_N: U1.H3(IO,_DIFFIO_L7n) ; port Part2_DigCh7_N
Part2_DigCh7_P: U1.H4(IO,_DIFFIO_L7p) ; port Part2_DigCh7_P
Part2_DigCh8_N: U1.H1(IO,_DIFFIO_L13n,_(DQ0L)/(DQ1L)/(DQ1L)) ; port Part2_DigCh8_N
Part2_DigCh8_P: U1.H2(IO,_DIFFIO_L13p,_(DQ0L)/(DQ1L)/(DQ1L)) ; port Part2_DigCh8_P
Part3_DigCh1_N: U1.J1(IO,_DIFFIO_L15n,_(DQ0L)/(DQ1L)/(DQ1L)) ; port Part3_DigCh1_N
Part3_DigCh1_P: U1.J2(IO,_DIFFIO_L15p,_(DQ0L)/(DQ1L)/(DQ1L)) ; port Part3_DigCh1_P
Part3_DigCh2_N: U1.M6(IO,_DIFFIO_L16n,_(DQ0L)/(DQ1L)/(DQ1L)) ; port Part3_DigCh2_N
Part3_DigCh2_P: U1.L6(IO,_DIFFIO_L16p,_(DQ0L)/(DQ1L)/(DQ1L)) ; port Part3_DigCh2_P
Part3_DigCh3_N: U1.M3(IO,_DIFFIO_L18n,_(DQ1L)/(DQ3L)/(DQ1L)) ; port Part3_DigCh3_N
Part3_DigCh3_P: U1.M4(IO,_DIFFIO_L18p,_(DM0L)/(DM1L/BWS#1L)/(DM1L/BWS#1L)) ; port Part3_DigCh3_P
Part3_DigCh4_N: U1.P7(IO,_DIFFIO_L30n) ; port Part3_DigCh4_N
Part3_DigCh4_P: U1.N7(IO,_DIFFIO_L30p) ; port Part3_DigCh4_P
Part3_DigCh5_N: U1.N6(IO,_DIFFIO_L26n,_(DQ3L)/(DQ3L)/(DQ1L)) ; port Part3_DigCh5_N
Part3_DigCh5_P: U1.P5(IO,_DIFFIO_L26p) ; port Part3_DigCh5_P
Part3_DigCh6_N: U1.P3(IO,_DIFFIO_L23n,_(DQ1L)/(DQ3L)/(DQ1L)) ; port Part3_DigCh6_N
Part3_DigCh6_P: U1.P4(IO,_DIFFIO_L23p,_(DQS1L/CQ1L#,DPCLK1)/(DQS1L/CQ1L#,DPCLK1)/(DQS1L/CQ1L#,DPCLK1)) ; port Part3_DigCh6_P
Part3_DigCh7_N: U1.R3(IO,_DIFFIO_L27n) ; port Part3_DigCh7_N
Part3_DigCh7_P: U1.R4(IO,_DIFFIO_L27p) ; port Part3_DigCh7_P
Part3_DigCh8_N: U1.R6(IO,_DIFFIO_L33n) ; port Part3_DigCh8_N
Part3_DigCh8_P: U1.T5(IO,_DIFFIO_L33p,_(DM3L/BWS#3L)/(DM3L/BWS#3L)/(DM1L/BWS#1L)) ; port Part3_DigCh8_P
Part4_DigCh1_N: U1.M1(IO,_DIFFIO_L17n,__/(DQ1L)/(DQ1L)) ; port Part4_DigCh1_N
Part4_DigCh1_P: U1.M2(IO,_DIFFIO_L17p,_(DQ0L)/(DQ1L)/(DQ1L)) ; port Part4_DigCh1_P
Part4_DigCh2_N: U1.N1(IO,_DIFFIO_L19n,_(DQ1L)/(DQ3L)/(DQ1L)) ; port Part4_DigCh2_N
Part4_DigCh2_P: U1.N2(IO,_DIFFIO_L19p,_(DQ1L)/(DQ3L)/(DQ1L)) ; port Part4_DigCh2_P
Part4_DigCh3_N: U1.P1(IO,_DIFFIO_L20n,_(DQ1L)/(DQ3L)/(DQ1L)) ; port Part4_DigCh3_N
Part4_DigCh3_P: U1.P2(IO,_DIFFIO_L20p,_(DQ1L)/(DQ3L)/(DQ1L)) ; port Part4_DigCh3_P
Part4_DigCh4_N: U1.R1(IO,_DIFFIO_L21n,_(DQ1L)/(DQ3L)/(DQ1L)) ; port Part4_DigCh4_N
Part4_DigCh4_P: U1.R2(IO,_DIFFIO_L21p,_(DQ1L)/(DQ3L)/(DQ1L)) ; port Part4_DigCh4_P
Part4_DigCh5_N: U1.U1(IO,_DIFFIO_L24n,_(DQ3L)/(DQ3L)/(DQ1L)) ; port Part4_DigCh5_N
Part4_DigCh5_P: U1.U2(IO,_DIFFIO_L24p,_(DM1L/BWS#1L)/(DM3L/BWS#3L)/(DM1L/BWS#1L)) ; port Part4_DigCh5_P
Part4_DigCh6_N: U1.V1(IO,_DIFFIO_L25n,_(DQ3L)/(DQ3L)/(DQ1L)) ; port Part4_DigCh6_N
Part4_DigCh6_P: U1.V2(IO,_DIFFIO_L25p,_(DQ3L)/(DQ3L)/(DQ1L)) ; port Part4_DigCh6_P
Part4_DigCh7_N: U1.W1(IO,_DIFFIO_L28n,_(DQ3L)/(DQ3L)/(DQ1L)) ; port Part4_DigCh7_N
Part4_DigCh7_P: U1.W2(IO,_DIFFIO_L28p,_(DQ3L)/(DQ3L)/(DQ1L)) ; port Part4_DigCh7_P
Part4_DigCh8_N: U1.Y1(IO,_DIFFIO_L29n,_(DQ3L)/(DQ3L)/(DQ1L)) ; port Part4_DigCh8_N
Part4_DigCh8_P: U1.Y2(IO,_DIFFIO_L29p,_(DQ3L)/(DQ3L)/(DQ1L)) ; port Part4_DigCh8_P
Part5_DigCh1_N: U1.Y3(IO,_DIFFIO_B3n,_(DQ3B)/(DQ3B)/(DQ5B)) ; port Part5_DigCh1_N
Part5_DigCh1_P: U1.Y4(IO,_DIFFIO_B3p) ; port Part5_DigCh1_P
Part5_DigCh2_N: U1.AB5(IO,_DIFFIO_B6n) ; port Part5_DigCh2_N
Part5_DigCh2_P: U1.AB6(IO,_DIFFIO_B6p) ; port Part5_DigCh2_P
Part5_DigCh3_N: U1.AA6(IO,_DIFFIO_B5n) ; port Part5_DigCh3_N
Part5_DigCh3_P: U1.AA5(IO,_DIFFIO_B5p,_(DQ3B)/(DQ3B)/(DQ5B)) ; port Part5_DigCh3_P
Part5_DigCh4_N: U1.AB7(IO,_DIFFIO_B10n,_(DQ5B)/(DQ3B)/(DQ5B)) ; port Part5_DigCh4_N
Part5_DigCh4_P: U1.AA7(IO,_DIFFIO_B10p,_(DM5B/BWS#5B)/(DM3B/BWS#3B)/(DM5B/BWS#5B)) ; port Part5_DigCh4_P
Part5_DigCh5_N: U1.AB8(IO,_DIFFIO_B17n,_(DQ5B)/(DQ3B)/(DQ5B)) ; port Part5_DigCh5_N
Part5_DigCh5_P: U1.AA8(IO,_DIFFIO_B17p,_(DQ5B)/(DQ3B)/(DQ5B)) ; port Part5_DigCh5_P
Part5_DigCh6_N: U1.AB9(IO,_DIFFIO_B18n,_(DQS5B/CQ5B#,DPCLK3)/(DQS5B/CQ5B#,DPCLK3)/(DQS5B/CQ5B#,DPCLK3)) ; port Part5_DigCh6_N
Part5_DigCh6_P: U1.AA9(IO,_DIFFIO_B18p,_(DQ5B)/(DQ3B)/(DQ5B)) ; port Part5_DigCh6_P
Part5_DigCh7_N: U1.Y10(IO,_DIFFIO_B20n,_(DQ5B)/(DQ3B)/(DQ5B)) ; port Part5_DigCh7_N
Part5_DigCh7_P: U1.W10(IO,_DIFFIO_B20p,_(DQ5B)/(DQ3B)/(DQ5B)) ; port Part5_DigCh7_P
Part5_DigCh8_N: U1.AB10(IO,_DIFFIO_B21n,__/(DQ5B)/(DQ5B)) ; port Part5_DigCh8_N
Part5_DigCh8_P: U1.AA10(IO,_DIFFIO_B21p,_(DM4B)/(DM5B/BWS#5B)/(DM5B/BWS#5B)) ; port Part5_DigCh8_P
PLL_CLK: U1.G1(CLK1,_DIFFCLK_0n) UG2.3(OUT) UG2.6(OUT)
Pre Beam time_N: U1.D22(IO,_DIFFIO_R7n,_(DM2R)/(DM1R/BWS#1R)/(DM1R/BWS#1R)) ; port Pre Beam time_N
Pre Beam time_P: U1.D21(IO,_DIFFIO_R7p,__/(DQ1R)/(DQ1R)) ; port Pre Beam time_P
Signal Window_N: U1.J22(IO,_DIFFIO_R15n,_(DQS0R/CQ1R,DPCLK7)/(DQS0R/CQ1R,DPCLK7)/(DQS0R/CQ1R,DPCLK7)) ; port Signal Window_N
Signal Window_P: U1.J21(IO,_DIFFIO_R15p,_(DM0R)/(DM1R/BWS#1R)/(DM1R/BWS#1R)) ; port Signal Window_P
Status IN 1_N: U1.A16(IO,_DIFFIO_T30n,_(DM2T)/(DM5T/BWS#5T)/(DM5T/BWS#5T)) ; port Status IN 1_N
Status IN 1_P: U1.B16(IO,_DIFFIO_T30p,_(DQ4T)/(DQ5T)/(DQ5T)) ; port Status IN 1_P
Status IN 2_N: U1.F15(IO,_DIFFIO_T41n,_(DQ2T)/(DQ5T)/(DQ5T)) ; port Status IN 2_N
Status IN 2_P: U1.G16(IO,_DIFFIO_T41p) ; port Status IN 2_P
Status IN 3_N: U1.D15(IO,_DIFFIO_T33n) ; port Status IN 3_N
Status IN 3_P: U1.E15(IO,_DIFFIO_T33p,_(DQ2T)/(DQ5T)/(DQ5T)) ; port Status IN 3_P
Status IN 4_N: U1.F16(IO,_DIFFIO_T42n) ; port Status IN 4_N
Status IN 4_P: U1.E16(IO,_DIFFIO_T42p,_(DQ2T)/(DQ5T)/(DQ5T)) ; port Status IN 4_P
SW_FCT-CLK: U1.A14(IO,_DIFFIO_T25n,_(PADD9),_(DQ4T)/(DQ5T)/(DQ5T)) UG2.8(CONTROL)
SW_Quartz: U1.B13(IO,_DIFFIO_T24p,_(PADD12),_(DQS4T/CQ5T,DPCLK9)/(DQS4T/CQ5T,DPCLK9)/(DQS4T/CQ5T,DPCLK9)) UG2.1(CONTROL)
TCK: R8.2 U1.L2(TCK)
TDI: R6.2 U1.L5(TDI)
Test0: U1.W13(IO,_DIFFIO_B26p,_(DQ4B)/(DQ5B)/(DQ5B))
Test1: U1.W14(IO,_DIFFIO_B31n)
Test2: U1.W15(IO,_DIFFIO_B35p,_(DQ2B)/(DQ5B)/(DQ5B))
Test3: U1.Y13(IO,_DIFFIO_B26n,_(DQS4B/CQ5B,DPCLK4)/(DQS4B/CQ5B,DPCLK4)/(DQS4B/CQ5B,DPCLK4))
Test4: U1.Y14(IO,_DIFFIO_B29p)
Test5: U1.Y15(IO,_DIFFIO_B29n)
TMS: R7.2 U1.L1(TMS)
Trig_Light: U1.C7(IO,_DIFFIO_T13p,_(DATA13),_(DM5T/BWS#5T)/(DM3T/BWS#3T)/(DM5T/BWS#5T)) ; port LED_Trig
Trigger data1_N: U1.N22(IO,_DIFFIO_R20n,_(DEV_OE)) ; port Trigger data 1_N
Trigger data1_P: U1.N21(IO,_DIFFIO_R20p,_(DEV_CLRn)) ; port Trigger data 1_P
Trigger data2_N: U1.U22(IO,_DIFFIO_R27n,_(DQ3R)/(DQ3R)/(DQ1R)) ; port Trigger data 2_N
Trigger data2_P: U1.U21(IO,_DIFFIO_R27p,_(DQ3R)/(DQ3R)/(DQ1R)) ; port Trigger data 2_P
Trigger data3_N: U1.R18(IO,_DIFFIO_R26n) ; port Trigger data 3_N
Trigger data3_P: U1.R19(IO,_DIFFIO_R26p,_(DM1R/BWS#1R)/(DM3R/BWS#3R)/(DM1R/BWS#1R)) ; port Trigger data 3_P
Trigger data4_N: U1.M20(IO,_DIFFIO_R18n,_(DQ1R)/(DQ3R)/(DQ1R)) ; port Trigger data 4_N
Trigger data4_P: U1.M19(IO,_DIFFIO_R18p,_(DQ1R)/(DQ3R)/(DQ1R)) ; port Trigger data 4_P
Trigger data5_N: U1.R22(IO,_DIFFIO_R24n,_(DQ1R)/(DQ3R)/(DQ1R)) ; port Trigger data 5_N
Trigger data5_P: U1.R21(IO,_DIFFIO_R24p,_(DQ1R)/(DQ3R)/(DQ1R)) ; port Trigger data 5_P
Trigger data6_N: U1.U20(IO,_DIFFIO_R34n,_(DQ3R)/(DQ3R)/(DQ1R)) ; port Trigger data 6_N
Trigger data6_P: U1.U19(IO,_DIFFIO_R34p) ; port Trigger data 6_P
Trigger data7_N: U1.W22(IO,_DIFFIO_R32n,_(DQ3R)/(DQ3R)/(DQ1R)) ; port Trigger data 7_N
Trigger data7_P: U1.W21(IO,_DIFFIO_R32p,_(DQ3R)/(DQ3R)/(DQ1R)) ; port Trigger data 7_P
Trigger data8_N: U1.V22(IO,_DIFFIO_R29n,_(DQ3R)/(DQ3R)/(DQ1R)) ; port Trigger data 8_N
Trigger data8_P: U1.V21(IO,_DIFFIO_R29p,_(DQ3R)/(DQ3R)/(DQ1R)) ; port Trigger data 8_P
Trigger data9_N: U1.C22(IO,_DIFFIO_R4n,_(DQ2R)/(DQ1R)/(DQ1R)) ; port Trigger data 9_N
Trigger data9_P: U1.C21(IO,_DIFFIO_R4p,_(DQ2R)/(DQ1R)/(DQ1R)) ; port Trigger data 9_P
Trigger data10_N: U1.C20(IO,_DIFFIO_R2n,_(PADD20),_(DQS2R/CQ3R,CDPCLK5)/(DQS2R/CQ3R,CDPCLK5)/(DQS2R/CQ3R,CDPCLK5)) ; port Trigger data 10_N
Trigger data10_P: U1.D20(IO,_DIFFIO_R2p) ; port Trigger data 10_P
Trigger data11_N: U1.F22(IO,_DIFFIO_R11n,_(DQ0R)/(DQ1R)/(DQ1R)) ; port Trigger data 11_N
Trigger data11_P: U1.F21(IO,_DIFFIO_R11p,_(DQ0R)/(DQ1R)/(DQ1R)) ; port Trigger data 11_P
Trigger data12_N: U1.H22(IO,_DIFFIO_R14n,_(DQ0R)/(DQ1R)/(DQ1R)) ; port Trigger data 12_N
Trigger data12_P: U1.H21(IO,_DIFFIO_R14p,_(DQ0R)/(DQ1R)/(DQ1R)) ; port Trigger data 12_P
Trigger data13_N: U1.K17(IO,_DIFFIO_R13n) ; port Trigger data 13_N
Trigger data13_P: U1.K18(IO,_DIFFIO_R13p,_(DQ0R)/(DQ1R)/(DQ1R)) ; port Trigger data 13_P
Trigger data14_N: U1.M22(IO,_DIFFIO_R19n,_(DQ1R)/(DQ3R)/(DQ1R)) ; port Trigger data 14_N
Trigger data14_P: U1.M21(IO,_DIFFIO_R19p,_(DQ1R)/(DQ3R)/(DQ1R)) ; port Trigger data 14_P
Trigger data15_N: U1.P22(IO,_DIFFIO_R23n,_(DQ1R)/(DQ3R)/(DQ1R)) ; port Trigger data 15_N
Trigger data15_P: U1.P21(IO,_DIFFIO_R23p,_(DQ1R)/(DQ3R)/(DQ1R)) ; port Trigger data 15_P
Trigger data16_N: U1.N20(IO,_DIFFIO_R22n,_(DQ1R)/(DQ3R)/(DQ1R)) ; port Trigger data 16_N
Trigger data16_P: U1.N19(IO,_DIFFIO_R22p) ; port Trigger data 16_P
Trigger data17_N: U1.H20(IO,_DIFFIO_R9n,_(DQ0R)/(DQ1R)/(DQ1R)) ; port Trigger data 17_N
Trigger data17_P: U1.H19(IO,_DIFFIO_R9p,_(DQ0R)/(DQ1R)/(DQ1R)) ; port Trigger data 17_P
Trigger data18_N: U1.F17(IO,_DIFFIO_R1n,_(DQ2R)/(DQ1R)/(DQ1R)) ; port Trigger data 18_N
Trigger data18_P: U1.G17(IO,_DIFFIO_R1p) ; port Trigger data 18_P
Trigger data19_N: U1.G18(IO,_DIFFIO_R5n,_(PADD23),_(DQ2R)/(DQ1R)/(DQ1R)) ; port Trigger data 19_N
Trigger data19_P: U1.H17(IO,_DIFFIO_R5p) ; port Trigger data 19_P
Trigger data20_N: U1.F20(IO,_DIFFIO_R6n,_(nAVD),_(DQ2R)/(DQ1R)/(DQ1R)) ; port Trigger data 20_N
Trigger data20_P: U1.F19(IO,_DIFFIO_R6p,_(DQ2R)/(DQ1R)/(DQ1R)) ; port Trigger data 20_P
Trigger data21_N: U1.N17(IO,_DIFFIO_R21n) ; port Trigger data 21_N
Trigger data21_P: U1.N18(IO,_DIFFIO_R21p,_(DQS1R/CQ1R#,DPCLK6)/(DQS1R/CQ1R#,DPCLK6)/(DQS1R/CQ1R#,DPCLK6)) ; port Trigger data 21_P
Trigger data22_N: U1.J20(IO,_DIFFIO_R10n) ; port Trigger data 22_N
Trigger data22_P: U1.J19(IO,_DIFFIO_R10p) ; port Trigger data 22_P
Trigger data23_N: U1.T20(IO,_DIFFIO_R31n) ; port Trigger data 23_N
Trigger data23_P: U1.T19(IO,_DIFFIO_R31p) ; port Trigger data 23_P
Trigger data24_N: U1.Y22(IO,_DIFFIO_R35n,_(DQ3R)/(DQ3R)/(DQ1R)) ; port Trigger data 24_N
Trigger data24_P: U1.Y21(IO,_DIFFIO_R35p) ; port Trigger data 24_P
Trigger data25_N: port Trigger data 25_N
Trigger data25_P: port Trigger data 25_P
Trigger data26_N: port Trigger data 26_N
Trigger data26_P: port Trigger data 26_P
Trigger data27_N: port Trigger data 27_N
Trigger data27_P: port Trigger data 27_P
Trigger data28_N: port Trigger data 28_N
Trigger data28_P: port Trigger data 28_P
Trigger data29_N: port Trigger data 29_N
Trigger data29_P: port Trigger data 29_P
Trigger data30_N: port Trigger data 30_N
Trigger data30_P: port Trigger data 30_P
Trigger data31_N: port Trigger data 31_N
Trigger data31_P: port Trigger data 31_P
Trigger data32_N: port Trigger data 32_N
Trigger data32_P: port Trigger data 32_P
Trigger data33_N: port Trigger data 33_N
Trigger data33_P: port Trigger data 33_P
Trigger data34_N: port Trigger data 34_N
Trigger data34_P: port Trigger data 34_P
Trigger data35_N: port Trigger data 35_N
Trigger data35_P: port Trigger data 35_P
Trigger data36_N: port Trigger data 36_N
Trigger data36_P: port Trigger data 36_P
Trigger data37_N: port Trigger data 37_N
Trigger data37_P: port Trigger data 37_P
Trigger data38_N: port Trigger data 38_N
Trigger data38_P: port Trigger data 38_P
Trigger data39_N: port Trigger data 39_N
Trigger data39_P: port Trigger data 39_P
Trigger data40_N: port Trigger data 40_N
Trigger data40_P: port Trigger data 40_P
Trigger data41_N: port Trigger data 41_N
Trigger data41_P: port Trigger data 41_P
Trigger data42_N: port Trigger data 42_N
Trigger data42_P: port Trigger data 42_P
Trigger data43_N: port Trigger data 43_N
Trigger data43_P: port Trigger data 43_P
Trigger data44_N: port Trigger data 44_N
Trigger data44_P: port Trigger data 44_P
Trigger data45_N: port Trigger data 45_N
Trigger data45_P: port Trigger data 45_P
Trigger data46_N: port Trigger data 46_N
Trigger data46_P: port Trigger data 46_P
Trigger data47_N: port Trigger data 47_N
Trigger data47_P: port Trigger data 47_P
Trigger data48_N: port Trigger data 48_N
Trigger data48_P: port Trigger data 48_P
Trigger data49_N: port Trigger data 49_N
Trigger data49_P: port Trigger data 49_P
Trigger data50_N: port Trigger data 50_N
Trigger data50_P: port Trigger data 50_P
Trigger data51_N: port Trigger data 51_N
Trigger data51_P: port Trigger data 51_P
Trigger data52_N: port Trigger data 52_N
Trigger data52_P: port Trigger data 52_P
Trigger data53_N: port Trigger data 53_N
Trigger data53_P: port Trigger data 53_P
Trigger data54_N: port Trigger data 54_N
Trigger data54_P: port Trigger data 54_P
Trigger data55_N: port Trigger data 55_N
Trigger data55_P: port Trigger data 55_P
Trigger data56_N: port Trigger data 56_N
Trigger data56_P: port Trigger data 56_P
Trigger data57_N: port Trigger data 57_N
Trigger data57_P: port Trigger data 57_P
Trigger data58_N: port Trigger data 58_N
Trigger data58_P: port Trigger data 58_P
Trigger data59_N: port Trigger data 59_N
Trigger data59_P: port Trigger data 59_P
Trigger data60_N: port Trigger data 60_N
Trigger data60_P: port Trigger data 60_P
Trigger data61_N: port Trigger data 61_N
Trigger data61_P: port Trigger data 61_P
Trigger data62_N: port Trigger data 62_N
Trigger data62_P: port Trigger data 62_P
Trigger data63_N: port Trigger data 63_N
Trigger data63_P: port Trigger data 63_P
Trigger data64_N: port Trigger data 64_N
Trigger data64_P: port Trigger data 64_P
Trigger_N: U1.A17(IO,_DIFFIO_T31n,_(PADD1),_(DQ2T)/(DQ5T)/(DQ5T)) ; port Trigger_N
Trigger_P: U1.B17(IO,_DIFFIO_T31p,_(PADD2),__/(DQ5T)/(DQ5T)) ; port Trigger_P
NetRL1_1: RL1.1 RL2.1 RL3.1 RL4.1

Not connected (* = marked no-connect by the designer): U1 A19(IO,_RDN4) A20(IO,_PLL2_CLKOUTn) AA1(IO,_DIFFIO_L31n,_(DQ3L)/(DQ3L)/(DQ1L)) AA3(IO,_PLL1_CLKOUTp) AA4(IO,_(DQ3B)/(DQ3B)/(DQ5B)) AA17(IO,_DIFFIO_B37p) AA18(IO,_VREFB4N0) AA19(IO,_RUP2) AA20(IO,_DIFFIO_B39p,__/(DQ5B)/(DQ5B)) AB3(IO,_PLL1_CLKOUTn) AB4(IO,_VREFB3N1) AB17(IO,_DIFFIO_B37n) AB18(IO,_(DQ2B)/(DQ5B)/(DQ5B)) AB19(IO,_RDN2) AB20(IO,_DIFFIO_B39n,_(DQ2B)/(DQ5B)/(DQ5B)) B5(IO,_VREFB8N1) B14(IO,_DIFFIO_T25p,_(PADD10),_(DQ4T)/(DQ5T)/(DQ5T)) B19(IO,_RUP4) B20(IO,_PLL2_CLKOUTp) C6(IO,_DIFFIO_T9n,_(DATA7),_(DQ3T)/(DQ3T)/(DQ5T)) C10(IO,_VREFB8N0) C13(IO,_DIFFIO_T26n,_(PADD7)) C15(IO,_VREFB7N1) C17(IO,_DIFFIO_T35p,_(DQ2T)/(DQ5T)/(DQ5T)) D2(IO,_DIFFIO_L5p,_(DQ2L)/(DQ1L)/(DQ1L)) D6(IO,_DIFFIO_T4n) D7(IO,_DIFFIO_T9p) D10(IO,_DIFFIO_T22n,_(DQ5T)/(DQ3T)/(DQ5T)) D13(IO,_DIFFIO_T26p,_(PADD8),_(DQ4T)/(DQ5T)/(DQ5T)) D17(IO,_VREFB7N0) E1(IO,_DIFFIO_L8n,__/(DQ1L)/(DQ1L)) E3(IO,_DIFFIO_L3n,_(DQ2L)/(DQ1L)/(DQ1L)) E4(IO,_DIFFIO_L3p,_(nRESET),_(DQ2L)/(DQ1L)/(DQ1L)) E5(IO,_PLL3_CLKOUTp) E6(IO,_PLL3_CLKOUTn) E7(IO,_DIFFIO_T4p) E9(IO,_DIFFIO_T14n) E10(IO,_DIFFIO_T22p) E11(IO,_DIFFIO_T23n,_(PADD13)) E12(IO,__/(DQ5T)/(DQ5T)) E13(IO) E14(IO,_DIFFIO_T28n,_(PADD3),_(DQ4T)/(DQ5T)/(DQ5T)) E21(IO,_DIFFIO_R8p,_(nOE),__/(DQ1R)/(DQ1R)) E22(IO,_DIFFIO_R8n,_(nWE),_(DQ0R)/(DQ1R)/(DQ1R)) F7(IO,_DIFFIO_T2n,_(DM3T/BWS#3T)/(DM3T/BWS#3T)/(DM5T/BWS#5T)) F8(IO,_DIFFIO_T7n,_(DATA9),_(DQ3T)/(DQ3T)/(DQ5T)) F9(IO) F10(IO,_DIFFIO_T10p,_(DATA6),_(DQ3T)/(DQ3T)/(DQ5T)) F11(IO,_DIFFIO_T23p,_(PADD14),_(DM4T)/(DM5T/BWS#5T)/(DM5T/BWS#5T)) F13(IO,_DIFFIO_T28p,_(PADD4),_(DQS2T/CQ3T,DPCLK8)/(DQS2T/CQ3T,DPCLK8)/(DQS2T/CQ3T,DPCLK8)) F14(IO,_DIFFIO_T40p,_(DQS0T/CQ1T,CDPCLK6)/(DQS0T/CQ1T,CDPCLK6)/(DQS0T/CQ1T,CDPCLK6)) G5(IO,_VREFB1N0) G7(IO,_DIFFIO_T2p) G8(IO,_DIFFIO_T7p) G10(IO,_DIFFIO_T10n) G11(IO,_DIFFIO_T18n) G13(IO,_DIFFIO_T32p) G14(IO,_DIFFIO_T32n) G15(IO,_DIFFIO_T40n) H5(IO,_VREFB1N1) H7(IO) H16(IO) H18(IO,_VREFB6N0) J3(IO,_DIFFIO_L14n) J4(IO,_DIFFIO_L12p,_(DQS0L/CQ1L,DPCLK0)/(DQS0L/CQ1L,DPCLK0)/(DQS0L/CQ1L,DPCLK0)) J5(IO) J17(IO) J18(IO,_DIFFIO_R12n) K19(IO,_VREFB6N1) K21(IO,_DIFFIO_R16p,_(CLKUSR)) K22(IO,_DIFFIO_R16n,_(nCEO)) L4(TDO) L21(IO,_DIFFIO_R17p,_(CRC_ERROR)) L22(IO,_DIFFIO_R17n,_(INIT_DONE)) M5(IO,_VREFB2N0) M16(IO) N5(IO,_DIFFIO_L22n,_(DQ1L)/(DQ3L)/(DQ1L)) N16(IO,_DIFFIO_R25p) P17(IO,_DIFFIO_R30p) P20(IO,_VREFB5N0) R14(IO,_DIFFIO_B41p) R15(IO,_DIFFIO_B41n) R16(IO,_PLL4_CLKOUTn) R17(IO,_DIFFIO_R30n) R20(IO,_DIFFIO_R28n,_(DQ3R)/(DQ3R)/(DQ1R)) T3(IO,_VREFB2N1) T4(IO,_(DQS3L/CQ3L#,CDPCLK1)/(DQS3L/CQ3L#,CDPCLK1)/(DQS3L/CQ3L#,CDPCLK1)) T10(IO,_DIFFIO_B13p) T11(IO,_DIFFIO_B13n) T14(IO,_DIFFIO_B36p) T15(IO,_DIFFIO_B36n,_(DQ2B)/(DQ5B)/(DQ5B)) T16(IO,_PLL4_CLKOUTp) T17(IO,_RUP3) T18(IO,_RDN3) U7(IO,_DIFFIO_B2p) U8(IO,_DIFFIO_B2n) U9(IO,_DIFFIO_B8p,_(DQ3B)/(DQ3B)/(DQ5B)) U10(IO,_DIFFIO_B16n,_(DQ5B)/(DQ3B)/(DQ5B)) U11(IO,_DIFFIO_B19p) U12(IO,_DIFFIO_B28p,_(DQ4B)/(DQ5B)/(DQ5B)) U13(IO,_DIFFIO_B32p) U14(IO,_DIFFIO_B33n) U15(IO,_DIFFIO_B34p) U16(IO,_DIFFIO_B40p) U17(IO,_DIFFIO_B40n) V3(IO,_RDN1) V4(IO,_RUP1) V5(IO,_DIFFIO_B1n,_(DM3B/BWS#3B)/(DM3B/BWS#3B)/(DM5B/BWS#5B)) V6(IO,_DIFFIO_B1p) V7(IO,_DIFFIO_B4n) V8(IO,_DIFFIO_B8n,_(DQ3B)/(DQ3B)/(DQ5B)) V9(IO,_VREFB3N0) V10(IO,_DIFFIO_B15p,_(DQS3B/CQ3B#,DPCLK2)/(DQS3B/CQ3B#,DPCLK2)/(DQS3B/CQ3B#,DPCLK2)) V11(IO,_DIFFIO_B19n,_(DQ5B)/(DQ3B)/(DQ5B)) V12(IO,_VREFB4N1) V13(IO,_DIFFIO_B31p,_(DQS2B/CQ3B,DPCLK5)/(DQS2B/CQ3B,DPCLK5)/(DQS2B/CQ3B,DPCLK5)) V14(IO,_DIFFIO_B33p,_(DQ2B)/(DQ5B)/(DQ5B)) V15(IO,_DIFFIO_B34n,_(DQ2B)/(DQ5B)/(DQ5B)) V16(IO) W6(IO,_DIFFIO_B4p,_(DQ3B)/(DQ3B)/(DQ5B)) W7(IO,_DIFFIO_B7p,_(DQ3B)/(DQ3B)/(DQ5B)) W8(IO,_(DQ3B)/(DQ3B)/(DQ5B)) W17(IO,_DIFFIO_B38p,_(DQ2B)/(DQ5B)/(DQ5B)) W19(IO,_VREFB5N1) W20(IO,_(DQS3R/CQ3R#,CDPCLK4)/(DQS3R/CQ3R#,CDPCLK4)/(DQS3R/CQ3R#,CDPCLK4)) Y6(IO,_(DQS1B/CQ1B#,CDPCLK2)/(DQS1B/CQ1B#,CDPCLK2)/(DQS1B/CQ1B#,CDPCLK2)) Y7(IO,_DIFFIO_B7n,_(DQ3B)/(DQ3B)/(DQ5B)) Y8(IO,_DIFFIO_B11p,_(DQ5B)/(DQ3B)/(DQ5B)) Y17(IO,_DIFFIO_B38n,_(DQS0B/CQ1B,CDPCLK3)/(DQS0B/CQ1B,CDPCLK3)/(DQS0B/CQ1B,CDPCLK3)); UL1 1(DATA) 5(GND) 13(WIRE+)

## Layout directives
differential pair: ADC_CLK_N, ADC_CLK_P, Beam time_N, Beam time_P, Busy_N, Busy_P, FCT_CLK_40MHz_N, FCT_CLK_40MHz_P, FCT_CLK_160MHz_N, FCT_CLK_160MHz_P, Hard reset_N, Hard reset_P, Part1_DigCh1_N, Part1_DigCh1_P, Part1_DigCh2_N, Part1_DigCh2_P, Part1_DigCh3_N, Part1_DigCh3_P, Part1_DigCh4_N, Part1_DigCh4_P, Part1_DigCh5_N, Part1_DigCh5_P, Part1_DigCh6_N, Part1_DigCh6_P, Part1_DigCh7_N, Part1_DigCh7_P, Part1_DigCh8_N, Part1_DigCh8_P, Part2_DigCh1_N, Part2_DigCh1_P, Part2_DigCh2_N, Part2_DigCh2_P, Part2_DigCh3_N, Part2_DigCh3_P, Part2_DigCh4_N, Part2_DigCh4_P, Part2_DigCh5_N, Part2_DigCh5_P, Part2_DigCh6_N, Part2_DigCh6_P, Part2_DigCh7_N, Part2_DigCh7_P, Part2_DigCh8_N, Part2_DigCh8_P, Part3_DigCh1_N, Part3_DigCh1_P, Part3_DigCh2_N, Part3_DigCh2_P, Part3_DigCh3_N, Part3_DigCh3_P, Part3_DigCh4_N, Part3_DigCh4_P, Part3_DigCh5_N, Part3_DigCh5_P, Part3_DigCh6_N, Part3_DigCh6_P, Part3_DigCh7_N, Part3_DigCh7_P, Part3_DigCh8_N, Part3_DigCh8_P, Part4_DigCh1_N, Part4_DigCh1_P, Part4_DigCh2_N, Part4_DigCh2_P, Part4_DigCh3_N, Part4_DigCh3_P, Part4_DigCh4_N, Part4_DigCh4_P, Part4_DigCh5_N, Part4_DigCh5_P, Part4_DigCh6_N, Part4_DigCh6_P, Part4_DigCh7_N, Part4_DigCh7_P, Part4_DigCh8_N, Part4_DigCh8_P, Part5_DigCh1_N, Part5_DigCh1_P, Part5_DigCh2_N, Part5_DigCh2_P, Part5_DigCh3_N, Part5_DigCh3_P, Part5_DigCh4_N, Part5_DigCh4_P, Part5_DigCh5_N, Part5_DigCh5_P, Part5_DigCh6_N, Part5_DigCh6_P, Part5_DigCh7_N, Part5_DigCh7_P, Part5_DigCh8_N, Part5_DigCh8_P, Pre Beam time_N, Pre Beam time_P, Signal Window_N, Signal Window_P, Status IN 1_N, Status IN 1_P, Status IN 2_N, Status IN 2_P, Status IN 3_N, Status IN 3_P, Status IN 4_N, Status IN 4_P, Trigger data1_N, Trigger data1_P, Trigger data2_N, Trigger data2_P, Trigger data3_N, Trigger data3_P, Trigger data4_N, Trigger data4_P, Trigger data5_N, Trigger data5_P, Trigger data6_N, Trigger data6_P, Trigger data7_N, Trigger data7_P, Trigger data8_N, Trigger data8_P, Trigger data9_N, Trigger data9_P, Trigger data10_N, Trigger data10_P, Trigger data11_N, Trigger data11_P, Trigger data12_N, Trigger data12_P, Trigger data13_N, Trigger data13_P, Trigger data14_N, Trigger data14_P, Trigger data15_N, Trigger data15_P, Trigger data16_N, Trigger data16_P, Trigger data17_N, Trigger data17_P, Trigger data18_N, Trigger data18_P, Trigger data19_N, Trigger data19_P, Trigger data20_N, Trigger data20_P, Trigger data21_N, Trigger data21_P, Trigger data22_N, Trigger data22_P, Trigger data23_N, Trigger data23_P, Trigger data24_N, Trigger data24_P, Trigger_N, Trigger_P

## Notes on the sheet
- (in symbol DS36C200, part A) Tx; G; Rx; U
- (in symbol DS36C200, part B) Tx; G; Rx; U
- (in symbol EP4CE55F23C6, part A) BANK 1
- (in symbol EP4CE55F23C6, part B) BANK 2
- (in symbol EP4CE55F23C6, part C) BANK 3
- (in symbol EP4CE55F23C6, part D) BANK 4
- (in symbol EP4CE55F23C6, part E) BANK 5
- (in symbol EP4CE55F23C6, part F) BANK 6
- (in symbol EP4CE55F23C6, part G) BANK 7
- (in symbol EP4CE55F23C6, part H) BANK 8
- (in symbol MAX4651PP, part A) +; G
- (in symbol MAX4651PP, part B) +; G
- (in symbol SG-636) Crystal; Oscillator

## Library data of the parts
C4-C26 Cgen1 CL1 = C: Text Field1: 20; Text Field2: 10
ExtReset R3-R9 RL1-RL5 = R: Text Field1: 20; Text Field2: 20
SW1 = SW DIP8: Text Field1: 20; Text Field2: 90
U1 = EP4CE55F23C6: Cyclone IV Family FPGA, 2V Core, 324 I/O Pins, 4 PLLs, 484-Pin FBGA, Speed Grade 6, Commercial Grade; Published: 3-May-2010; DatasheetVersion: ver1.2, Mar-2010; PackageVersion: ver16.0, Dec-2009; PackageReference: FBGA484; Publisher: Altium Limited; PackageDescription: 484-Ball FineLine Ball Grid Array (FBGA484) - Flip Chip; Supplier 1: Digi-Key; Supplier Part Number 1: EP4CE55F23C6-ND; Code_JEDEC: MS-034-AAJ-1; Code_IPC: BGA100P22X22-484; ComponentLink1Description: Manufacturer Link; ComponentLink1URL: http://www.altera.com/; ComponentLink2Description: Handbook; ComponentLink2URL: http://www.altera.com/literature/hb/cyclone-iv/cyclone4-handbook.pdf; ComponentLink3Description: Pinout Specification; ComponentLink3URL: http://www.altera.com/literature/lit-dp.jsp?category=cyc%204&showspreadsheet=y; ComponentLink4Description: Packaging Specification; ComponentLink4URL: http://www.altera.com/literature/ds/dspkg.pdf
U2 = EPCS4SI8N: EPCS4 Series, In-system programmable 3.3V serial configuration device, 8-Pin SOIC, 4-Megabit, Industrial Grade, Pb-Free; Configures: Cyclone II, Stratix II, & Cyclone Devices; Published: 4-Mar-2005; LatestRevisionDate: 13-Apr-2006; LatestRevisionNote: IPC-7351 Footprint Added.; DatasheetVersion: ver2.0, Oct-2003; PackageVersion: ver14.2, Oct-2005; PackageReference: SOIC8; Publisher: Altium Limited; PackageDescription: 8-Pin Small Outline Integrated Circuit Package (SOIC8); Supplier 1: Digi-Key; Supplier Part Number 1: 544-1379-5-ND; Supplier 2: Farnell; Supplier Part Number 2: 1662262; Supplier 3: Farnell; Supplier Part Number 3: 1453496; Code_JEDEC: MS-012-AA; Code_IPC: SOIC127P600-8; ComponentLink1Description: Manufacturer Link; ComponentLink1URL: http://www.altera.com/products/devices/config/cfg-index.html; ComponentLink2Description: Configuration Handbook; ComponentLink2URL: http://www.altera.com/literature/hb/cfg/config_handbook.pdf; ComponentLink3Description: Pinout Specification; ComponentLink3URL: http://www.altera.com/literature/hb/cfg/cyc_c51014.pdf; ComponentLink4Description: Packaging Specification; ComponentLink4URL: http://www.altera.com/literature/ds/dspkg.pdf
U3 = IDC-10: Text Field1: 40; Text Field2: 60
UG1 = SG-636: Crystal Oscillator (SMD)
UG2 = MAX4651PP: Text Field1: 20; Text Field2: 40
UL1 = DS36C200: Text Field1: 60; Text Field2: 70